# Altium schematic sheet 5_Changing the gain.SchDoc
size A4; SheetNumber: 1; SheetTotal: 1; SPICEModelCacheCSPBSJPQ: <root> / <DocumentId>CSPBSJPQ</DocumentId> / <CacheFrame Number="0"> / <Model Name="bc846" Kind="MDL"> / <Text>.MODEL BC846 NPN(  BF=324.4 BR=8.29 CJC=3.347E-12 CJE=1.244E-11 FC=0.979 IKF=0.109 IKR=0.09 IRB=5E-06 IS=1.822E-14 ISC=9.982E-12 ISE=2.894E-16 ITF=0.3131 MJC=0.391 MJE=0.3656 MJS=0.333 NC=1.763 NE=1.4 NF=0.9932 NK=500M NR=0.9931 RB=10 RBM=5 RC=0.7014 RE=0.649 TF=4.908E-10 TR=9E-08 VAF=82 VAR=17.9 VJC=0.5463 VJE=0.7579 VTF=2.927 XCJC=0.6193 XTF=9.51 )</Text> / </Model> / </CacheFrame> / </root>
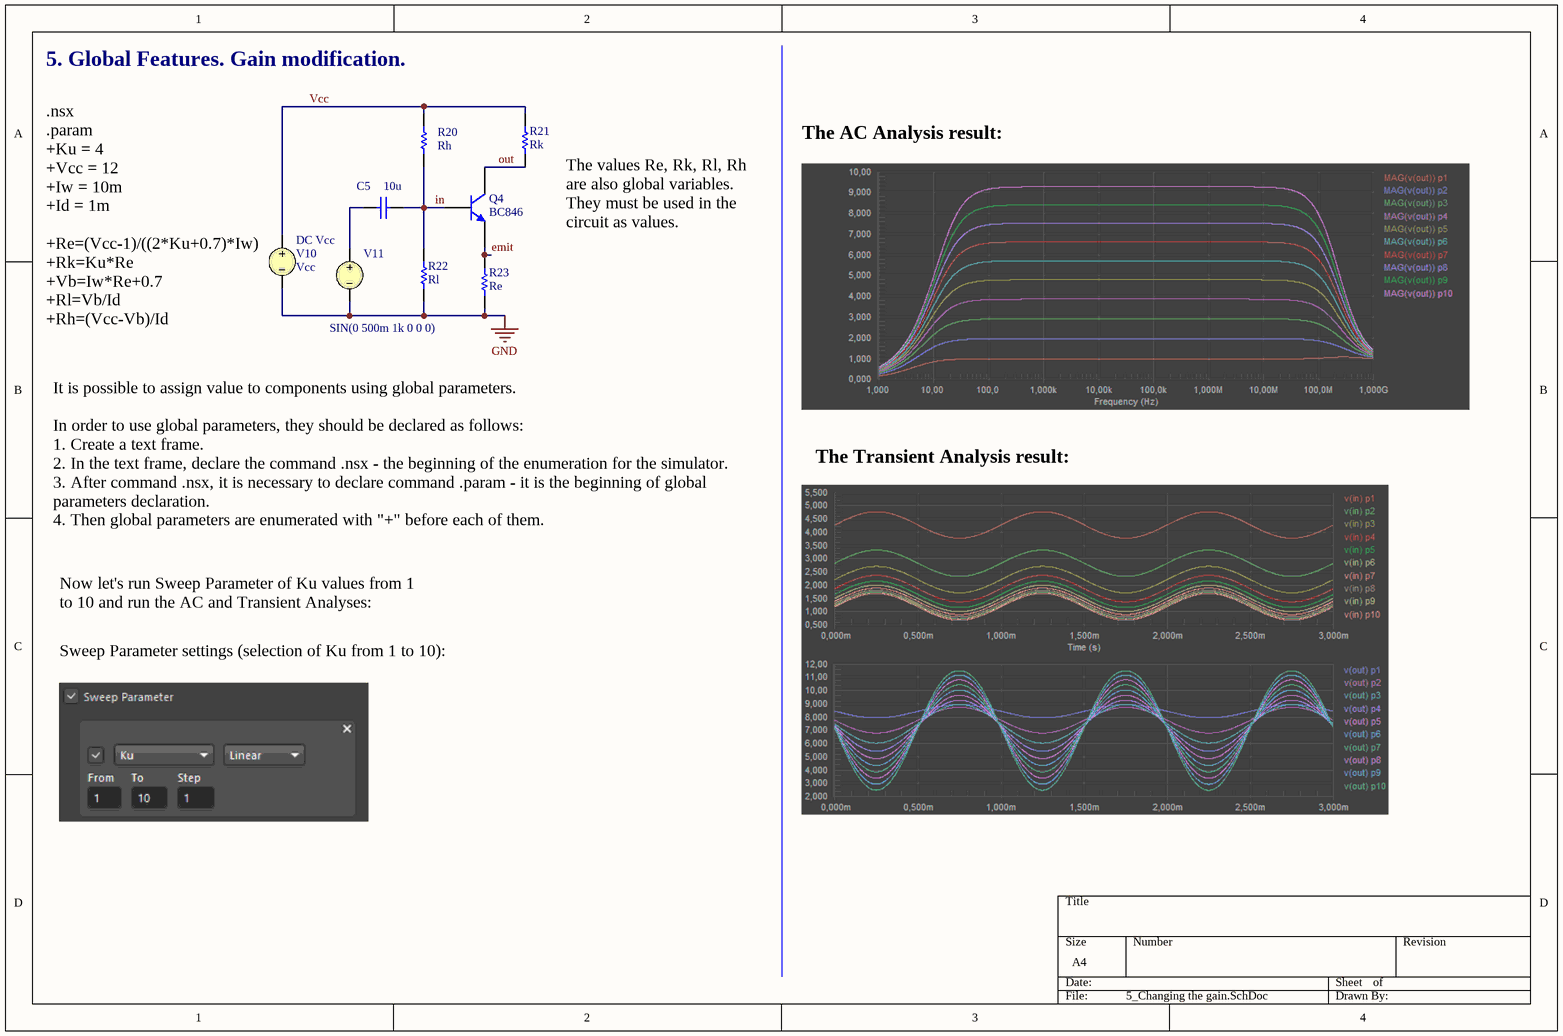
[diagram p0: 5_Changing the gain.SchDoc]

## Parts
C5  value 10u  (hidden comment: Capacitor)
Q4  BC846  [TO-92A]
R20  value Rh  (hidden comment: Resistor)
R21  value Rk  (hidden comment: Resistor)
R22  value Rl  (hidden comment: Resistor)
R23  value Re  (hidden comment: Resistor)
V10  DC Vcc  value Vcc
V11  SIN(0 500m 1k 0 0 0)

## Nets
GND: R22.2 R23.1 V10.2 V11.2
emit: Q4.1(E) R23.2
in: C5.2 Q4.2(B) R20.1 R22.1
out: Q4.3(C) R21.1
Vcc: R20.2 R21.2 V10.1
NetC5_1: C5.1 V11.1

## Notes on the sheet
- 5. Global Features. Gain modification.
- The AC Analysis result:
- (near R21) The values Re, Rk, Rl, Rh are also global variables. They must be used in the circuit as values.
- (near V10) .nsx
  .param
  +Ku = 4
  +Vcc = 12
  +Iw = 10m
  +Id = 1m
  +Re=(Vcc-1)/((2*Ku+0.7)*Iw)
  +Rk=Ku*Re
  +Vb=Iw*Re+0.7
  +Rl=Vb/Id
  +Rh=(Vcc-Vb)/Id
- The Transient Analysis result:
- It is possible to assign value to components using global parameters.
  In order to use global parameters, they should be declared as follows:
  1. Create a text frame.
  2. In the text frame, declare the command .nsx - the beginning of the enumeration for the simulator.
  3. After command .nsx, it is necessary to declare command .param - it is the beginning of global parameters declaration.
  4. Then global parameters are enumerated with "+" before each of them.
- Now let's run Sweep Parameter of Ku values from 1 to 10 and run the AC and Transient Analyses:
- Sweep Parameter settings (selection of Ku from 1 to 10):

## Library data of the parts
C5 = Capacitor: SimulationGenericComponent: True
Q4 = 2N3904: NPN General Purpose Amplifier; Published: 8-Jun-2000; LatestRevisionDate: 15-Jan-2003; LatestRevisionNote: PCB Footprint 'BCY-W3/D4.7' replaced; DatasheetVersion: 1997; PackageVersion: Sep-1998; PackageReference: TO-92A; Publisher: Altium Limited; PackageDescription: TO, Flat Index; 3 In-Line, Axial Leads; Body Dia. 4.5mm; Leads 0.51 x 0.48 mm (max); ComponentLink1Description: Manufacturer Link; ComponentLink1URL: http://www.fairchildsemi.com/; ComponentLink2Description: Datasheet; ComponentLink2URL: http://www.fairchildsemi.com/ds/2N%2F2N3904.pdf
V10 = VSRC: Voltage Source; Note: PCB Footprint - Not required; AC Magnitude: 0; Published: 30-July-2020; LatestRevisionDate: 30-July-2020; LatestRevisionNote: Re-released for DXP Platform.; PackageReference: Not Applicable; Publisher: Altium Limited
V11 = VSRC: Voltage Source; Note: PCB Footprint - Not required; DC Magnitude: 0; AC Magnitude: 1; Published: 30-July-2020; LatestRevisionDate: 30-July-2020; LatestRevisionNote: Re-released for DXP Platform.; PackageReference: Not Applicable; Publisher: Altium Limited; Offset: 0; Amplitude: 500m; Frequency: 1k; Delay: 0; Damping Factor: 0; Phase: 0